# EAGLE design mapleCUx_large_210 (EAGLE 7.3.0)
MAPLE-CUx Large Version
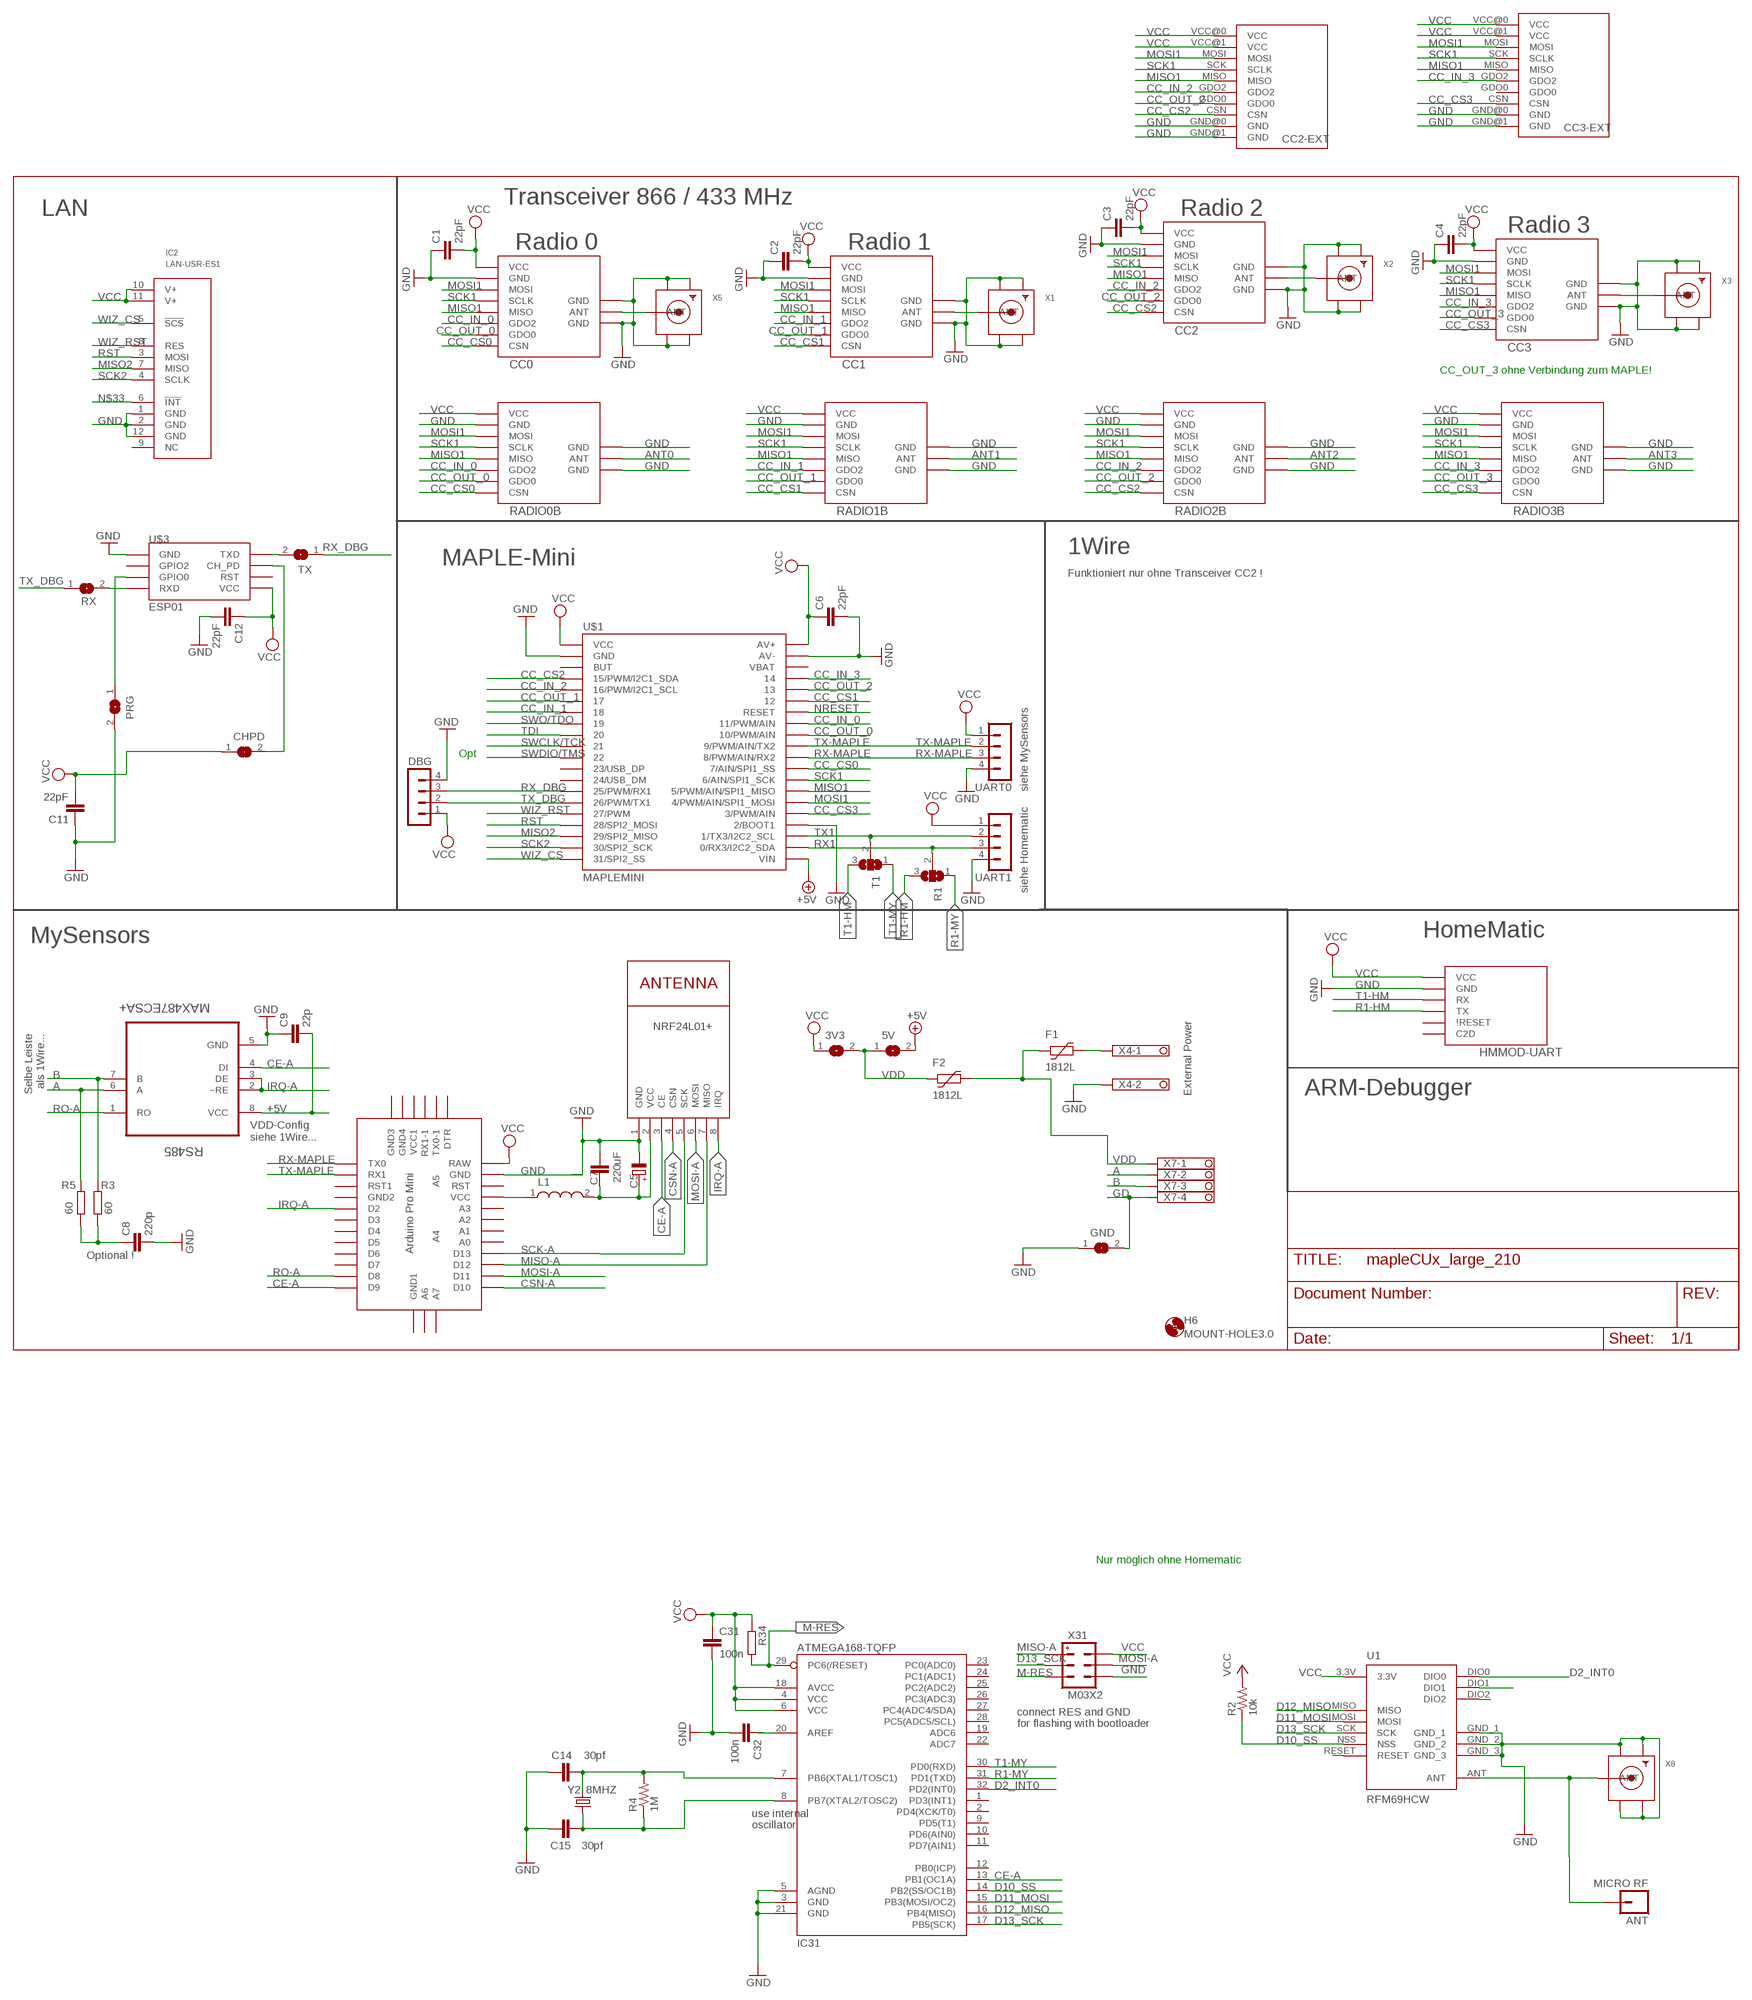
[diagram p0: schematic, sheet 1]

## Parts
3V3  SJ  [SJ]
5V  SJ  [SJ]
ANT  MICRO RF  M01PTH  [1X01]
C1  22pF  C-EUC0805  [C0805]
C2  22pF  C-EUC0805  [C0805]
C3  22pF  C-EUC0805  [C0805]
C4  22pF  C-EUC0805  [C0805]
C5  220uF  CPOL-EUE5-8.5  [E5-8,5]
C6  22pF  C-EUC0805  [C0805]
C7  C-EUC1812  [C1812]
C8  220p  C-EUC0805  [C0805]
C9  22p  C-EUC0805  [C0805]
C11  22pF  C-EUC0805  [C0805]
C12  22pF  C-EUC0805  [C0805]
C14  30pf  CAP0805  [0805]
C15  30pf  CAP0805  [0805]
C31  100n  C-EUC0805  [C0805]
C32  100n  C-EUC0805  [C0805]
CC0  CC1101  CC1101_MODULE1SMD  [CC1101_MODULE1_SMD]
CC1  CC1101_MODULE1SMD  [CC1101_MODULE1_SMD]
CC2  CC1101_MODULE1SMD  [CC1101_MODULE1_SMD]
CC2-EXT  CC1101_MODULE3_DIL  [CC1101_MODULE3_DIL]
CC3  CC1101_MODULE1SMD  [CC1101_MODULE1_SMD]
CC3-EXT  CC1101_MODULE3_DIL  [CC1101_MODULE3_DIL]
CHPD  SJ  [SJ]
DBG  MA04-1  [MA04-1]
F1  1812L  [1812L]
F2  1812L  [1812L]
GND  SJ  [SJ]
H6  MOUNT-HOLE3.0  [3,0]
HMMOD-UART  HM-MOD-UARTDIL  [HM-MOD-UART-DIL]
IC2  LAN-USR-ES1  [USR-ES1]
IC31  ATMEGA168-TQFP  [TQFP32-08]
L1  WE-KI_0805A  [WE-KI_0805A]
NRF24L01+  NRF24L01+  WIRELESS-NRF24L01  [WIRELESS-NRF24L01]
PRG  SJ  [SJ]
R1  SJ2W  [SJ_2]
R2  10k  RESISTOR0805-RES  [0805]
R3  60  R-EU_R0805  [R0805]
R4  1M  RESISTOR0805-RES  [0805]
R5  60  R-EU_R0805  [R0805]
R34  R-EU_R0805  [R0805]
RADIO0B  CC1101_MODULE1SMALL  [CC1101_MODULE1_SMD]
RADIO1B  CC1101_MODULE1SMALL  [CC1101_MODULE1_SMD]
RADIO2B  CC1101_MODULE1SMALL  [CC1101_MODULE1_SMD]
RADIO3B  CC1101_MODULE1SMALL  [CC1101_MODULE1_SMD]
RS485  MAX487ECSA+  [SOIC127P600X175-8N]
RX  SJ  [SJ]
T1  SJ2W  [SJ_2]
TX  SJ  [SJ]
U1  RFM69HCW  [RFM69HCW-XXXS2]
U$1  MAPLEMINI  [20-DIP]
U$2  ABK-PRO-MINI  [ABK-PRO-MINI]
U$3  ESP01  [ESP01]
UART0  MA04-1  [MA04-1]
UART1  MA04-1  [MA04-1]
X1  SMACONNECTOR_EDGE  [SMA_EDGELAUNCH]
X2  SMACONNECTOR_EDGE  [SMA_EDGELAUNCH]
X3  SMACONNECTOR_EDGE  [SMA_EDGELAUNCH]
X4  1751248  [1751248]
X5  SMACONNECTOR_EDGE  [SMA_EDGELAUNCH]
X7  1751264  [1751264]
X8  SMACONNECTOR_EDGE_UFL  [SMA_EDGELAUNCH_UFL]
X31  M03X2  [2X03-1.27MM_SMD]
Y2  8MHZ  CRYSTALTXC-7A  [CRYSTAL-TXC-7A]

## Nets
+5V [PWR]: 5V.2 C9.2 RS485.8(VCC) U$1.21(VIN)
A: R5.2 RS485.6(A) X7.2
ANT: ANT.1 U1.ANT X8.P(ANT)
ANT0: CC0.ANT RADIO0B.ANT X5.P(ANT)
ANT1: CC1.ANT RADIO1B.ANT X1.P(ANT)
ANT2: CC2.ANT RADIO2B.ANT X2.P(ANT)
ANT3: CC3.ANT RADIO3B.ANT X3.P(ANT)
B: R3.2 RS485.7(B) X7.3
CC_CS0: CC0.CSN RADIO0B.CSN U$1.29(7/AIN/SPI1_SS)
CC_CS1: CC1.CSN RADIO1B.CSN U$1.35
CC_CS2: CC2-EXT.CSN CC2.CSN RADIO2B.CSN U$1.4(15/PWM/I2C1_SDA)
CC_CS3: CC3-EXT.CSN CC3.CSN RADIO3B.CSN U$1.25(3/PWM/AIN)
CC_IN_0: CC0.GDO2 RADIO0B.GDO2 U$1.33(11/PWM/AIN)
CC_IN_1: CC1.GDO2 RADIO1B.GDO2 U$1.7
CC_IN_2: CC2-EXT.GDO2 CC2.GDO2 RADIO2B.GDO2 U$1.5(16/PWM/I2C1_SCL)
CC_IN_3: CC3-EXT.GDO2 CC3.GDO2 RADIO3B.GDO2 U$1.37
CC_OUT_0: CC0.GDO0 RADIO0B.GDO0 U$1.32(10/PWM/AIN)
CC_OUT_1: CC1.GDO0 RADIO1B.GDO0 U$1.6
CC_OUT_2: CC2-EXT.GDO0 CC2.GDO0 RADIO2B.GDO0 U$1.36
CC_OUT_3: CC3.GDO0 RADIO3B.GDO0
CE-A: IC31.13(PB1(OC1A)) NRF24L01+.3(CE) RS485.4(DI) U$2.D9
CSN-A: NRF24L01+.4(CSN) U$2.D10
D2_INT0: IC31.32(PD2(INT0)) U1.DIO0
D10_SS: IC31.14(PB2(SS/OC1B)) R2.1 U1.NSS
D11_MOSI: IC31.15(PB3(MOSI/OC2)) U1.MOSI
D12_MISO: IC31.16(PB4(MISO)) U1.MISO
D13_SCK: IC31.17(PB5(SCK)) U1.SCK X31.P$3
E+ [PWR]: F1.P$2 X4.1
GD [PWR]: GND.2 X7.4
GND [PWR]: C1.1 C2.1 C3.1 C4.1 C5.- C6.2 C7.1 C8.2 C9.1 C11.1 C12.2 C14.1 C15.1 C31.2 C32.2 CC0.GND@0(GND) CC0.GND@1(GND) CC0.GND@2(GND) CC1.GND@0(GND) CC1.GND@1(GND) CC1.GND@2(GND) CC2-EXT.GND@0(GND) CC2-EXT.GND@1(GND) CC2.GND@0(GND) CC2.GND@1(GND) CC2.GND@2(GND) CC3-EXT.GND@0(GND) CC3-EXT.GND@1(GND) CC3.GND@0(GND) CC3.GND@1(GND) CC3.GND@2(GND) DBG.4 GND.1 HMMOD-UART.2(GND) IC2.1(GND) IC2.2(GND) IC2.12(GND) IC31.3(GND) IC31.5(AGND) IC31.21(GND) NRF24L01+.1(GND) PRG.2 RADIO0B.GND@0(GND) RADIO0B.GND@1(GND) RADIO0B.GND@2(GND) RADIO1B.GND@0(GND) RADIO1B.GND@1(GND) RADIO1B.GND@2(GND) RADIO2B.GND@0(GND) RADIO2B.GND@1(GND) RADIO2B.GND@2(GND) RADIO3B.GND@0(GND) RADIO3B.GND@1(GND) RADIO3B.GND@2(GND) RS485.5(GND) U1.GND_1 U1.GND_2 U1.GND_3 U$1.2(GND) U$1.24(2/BOOT1) U$1.39(AV-) U$2.GND U$3.GND UART0.4 UART1.4 X1.GND@1(GND4) X1.GND@2(GND3) X1.GND@3(GND2) X1.GND@4(GND1) X2.GND@1(GND4) X2.GND@2(GND3) X2.GND@3(GND2) X2.GND@4(GND1) X3.GND@1(GND4) X3.GND@2(GND3) X3.GND@3(GND2) X3.GND@4(GND1) X4.2 X5.GND@1(GND4) X5.GND@2(GND3) X5.GND@3(GND2) X5.GND@4(GND1) X8.GND@1(GND1) X8.GND@2(GND2) X8.GND@3(GND3) X8.GND@4(GND4) X31.P$6
IRQ-A: NRF24L01+.8(IRQ) RS485.2(~RE) RS485.3(DE) U$2.D2
M-RES: IC31.29(PC6(/RESET)) R34.2 X31.P$5
MISO1: CC0.MISO CC1.MISO CC2-EXT.MISO CC2.MISO CC3-EXT.MISO CC3.MISO RADIO0B.MISO RADIO1B.MISO RADIO2B.MISO RADIO3B.MISO U$1.27(5/PWM/AIN/SPI1_MISO)
MISO2: IC2.7(MISO) U$1.18(29/SPI2_MISO)
MISO-A: NRF24L01+.7(MISO) U$2.D12 X31.P$1
MOSI1: CC0.MOSI CC1.MOSI CC2-EXT.MOSI CC2.MOSI CC3-EXT.MOSI CC3.MOSI RADIO0B.MOSI RADIO1B.MOSI RADIO2B.MOSI RADIO3B.MOSI U$1.26(4/PWM/AIN/SPI1_MOSI)
MOSI-A: NRF24L01+.6(MOSI) U$2.D11 X31.P$4
N$1 [PWR]: C5.+ C7.2 L1.2 NRF24L01+.2(VCC)
N$2 [PWR]: L1.1 U$2.VCC
N$6: C14.2 IC31.7(PB6(XTAL1/TOSC1)) R4.2 Y2.P$2
N$8: RX.2 U$3.RX(RXD)
N$10: TX.2 U$3.TX(TXD)
N$11: PRG.1 U$3.GPIO0
N$12: CHPD.2 U$3.CH_PD
N$13: C32.1 IC31.20(AREF)
N$14: U1.DIO2
N$15: U1.DIO1
N$16: U1.RESET
N$19: C15.2 IC31.8(PB7(XTAL2/TOSC2)) R4.1 Y2.P$1
N$21: C8.1 R3.1 R5.1
N$33: IC2.6(!INT!)
NRESET: U$1.34(RESET)
R1-HM: HMMOD-UART.5(TX) R1.3
R1-MY: IC31.31(PD1(TXD)) R1.1
RO-A: RS485.1(RO) U$2.D8
RST: IC2.3(MOSI) U$1.17(28/SPI2_MOSI)
RX1: R1.2 U$1.22(0/RX3/I2C2_SDA) UART1.3
RX-MAPLE: U$1.30(8/PWM/AIN/RX2) U$2.TX0 UART0.3
RX_DBG: DBG.3 TX.1 U$1.14(25/PWM/RX1)
SCK1: CC0.SCLK CC1.SCLK CC2-EXT.SCK(SCLK) CC2.SCLK CC3-EXT.SCK(SCLK) CC3.SCLK RADIO0B.SCLK RADIO1B.SCLK RADIO2B.SCLK RADIO3B.SCLK U$1.28(6/AIN/SPI1_SCK)
SCK2: IC2.4(SCLK) U$1.19(30/SPI2_SCK)
SCK-A: NRF24L01+.5(SCK) U$2.D13
SWCLK/TCK: U$1.10
SWDIO/TMS: U$1.11
SWO/TDO: U$1.8
T1-HM: HMMOD-UART.6(RX) T1.3
T1-MY: IC31.30(PD0(RXD)) T1.1
TDI: U$1.9
TX1: T1.2 U$1.23(1/TX3/I2C2_SCL) UART1.2
TX-MAPLE: U$1.31(9/PWM/AIN/TX2) U$2.RX1 UART0.2
TX_DBG: DBG.2 RX.1 U$1.15(26/PWM/TX1)
VCC [PWR]: 3V3.1 C1.2 C2.2 C3.2 C4.2 C6.1 C11.2 C12.1 C31.1 CC0.VCC CC1.VCC CC2-EXT.VCC@0(VCC) CC2-EXT.VCC@1(VCC) CC2.VCC CC3-EXT.VCC@0(VCC) CC3-EXT.VCC@1(VCC) CC3.VCC CHPD.1 DBG.1 HMMOD-UART.1(VCC) IC2.10(V+) IC2.11(V+) IC31.4(VCC) IC31.6(VCC) IC31.18(AVCC) R2.2 R34.1 RADIO0B.VCC RADIO1B.VCC RADIO2B.VCC RADIO3B.VCC U1.3.3V U$1.1(VCC) U$1.40(AV+) U$2.RAW U$3.VCC UART0.1 UART1.1 X31.P$2
VDD [PWR]: 3V3.2 5V.1 F1.P$1 F2.P$1 F2.P$2 X7.1
WIZ_CS: IC2.5(!SCS!) U$1.20(31/SPI2_SS)
WIZ_RST: IC2.8(RES) U$1.16(27/PWM)
Unconnected: CC3-EXT.GDO0 HMMOD-UART.3(C2D) HMMOD-UART.4(\!RESET) IC2.9(NC) IC31.1(PD3(INT1)) IC31.2(PD4(XCK/T0)) IC31.9(PD5(T1)) IC31.10(PD6(AIN0)) IC31.11(PD7(AIN1)) IC31.12(PB0(ICP)) IC31.19(ADC6) IC31.22(ADC7) IC31.23(PC0(ADC0)) IC31.24(PC1(ADC1)) IC31.25(PC2(ADC2)) IC31.26(PC3(ADC3)) IC31.27(PC4(ADC4/SDA)) IC31.28(PC5(ADC5/SCL)) U$1.3(BUT) U$1.12(23/USB_DP) U$1.13(24/USB_DM) U$1.38(VBAT) U$2.A0 U$2.A1 U$2.A2 U$2.A3 U$2.A4 U$2.A5 U$2.A6 U$2.A7 U$2.D3 U$2.D4 U$2.D5 U$2.D6 U$2.D7 U$2.DTR U$2.GND1(GND2) U$2.GND2(GND3) U$2.GND3(GND4) U$2.GND4(GND1) U$2.RST U$2.RST1 U$2.RX1-1 U$2.TX0-1 U$2.VCC1 U$3.GPIO2 U$3.RST

## Notes on the sheet
- Transceiver 866 / 433 MHz
- LAN | Radio 2
- Radio 3
- Radio 0 | Radio 1
- CC_OUT_3 ohne Verbindung zum MAPLE!
- 1Wire
- MAPLE-Mini
- Funktioniert nur ohne Transceiver CC2 !
- Opt
- siehe MySensors
- siehe Homematic
- MySensors | HomeMatic
- Selbe Leiste
  als 1Wire...
- External Power | ARM-Debugger
- VDD-Config
  siehe 1Wire...
- Optional !
- Nur möglich ohne Homematic
- connect RES and GND
- for flashing with bootloader
- use internal
- oscillator

## Library data of the parts
3V3 5V CHPD GND PRG RX TX = jumper:SJ: SMD solder JUMPER
ANT = SparkFun-Connectors:M01: Header 1 Standard 1-pin 0.1" header. Use with straight break away headers (SKU : PRT-00116), right angle break away headers (PRT-00553), swiss pins (PRT-00743), machine pins (PRT-00117), and female headers (PRT-00115).
C1-C4 C6-C9 C11 C12 C31 C32 = rcl:C-EU: CAPACITOR, European symbol
C5 = rcl:CPOL-EU: POLARIZED CAPACITOR, European symbol
C14 C15 = doug:CAP: Capacitor Standard 0603 ceramic capacitor, and 0.1" leaded capacitor.
CC0 CC1-CC3 = wireless:CC1101_MODULE1: CC1101 wireless module for 433/868 MHz (sold from Aliexpress). DIL version for mounting with pin header (and SMD soldering) and SMD only variant available.
CC2-EXT CC3-EXT = wireless:CC1101_MODULE3_DIL: 433 Mhz CC1101 wireless module named RF1101SE V3.1 package special has only limited silk screen on tPlace layer
DBG UART0 UART1 = con-lstb:MA04-1: PIN HEADER; OC_FARNELL: unknown; OC_NEWARK: unknown
F1 F2 = ptc-littlefuse:1812L
H6 = holes:MOUNT-HOLE: MOUNTING HOLE with drill center marker
HMMOD-UART = wireless:HM-MOD-UART: eQ3 HM-MOD-UART-AW-SH2 wireless module for 868 MHz. DIL version for mounting with pin header (antenna upwards) and SMD variant available (antenna downwards).
IC2 = Martin-Communication:LAN-USR-ES1
IC31 = atmel:ATMEGA168: Atmel Atmega 168/328/328P
L1 = EAGLE-EMC_COMPONENTS-rev17a:WE-KI: SMD Wire Wound Ceramic Inductor Characteristics WE-KI series offers you an excellent Q factor and highest possible self resonant frequencies up to 12.5 GHz Inductance tolerances: 5% (2% on request) High thermal stability Operating temperature: –40°C to +125°C Applications Especially developed for high frequency applications RF transceiver/communications Bluetooth Wireless LAN <http://katalog.we-online.de/media/images/v2/Family_WE-KI.jpg> Details see: http://katalog.we-online.de/en/pbs/WE-KI Updated by Dan Xu 2014-07-08 2014 (C) Wurth Elektronik
NRF24L01+ = diy-modules:WIRELESS-NRF24L01: 2.4 GHz Wireless Module based on NRF24L01 chip
R1 T1 = jumper:SJ2W: SMD solder JUMPER
R2 R4 = doug:RESISTOR: Resistor Basic schematic elements and footprints for 0603, 1206, and PTH resistors.
R3 R5 R34 = rcl:R-EU_: RESISTOR, European symbol
RADIO0B RADIO1B RADIO2B RADIO3B = Martin-Communication:CC1101_MODULE1: CC1101 wireless module for 433/868 MHz (sold from Aliexpress). DIL version for mounting with pin header (and SMD soldering) and SMD only variant available.
RS485 = Maxim_By_element14_Batch_1:MAX487ECSA+: Low-Power, Slew-Rate-Limited RS-485/RS-422 Transceivers; MPN: MAX487ECSA+; OC_FARNELL: 9724532; OC_NEWARK: 68K4803; PACKAGE: SOIC-8; SUPPLIER: Maxim
U1 = doug:RFM69H
U$1 = maplemini-small:MAPLEMINI
U$2 = Arduino-clone:ABK-PRO-MINI: ABK Pro-Mini Arduino Clone
U$3 = esp8266modules:ESP01: ESP8266 Wifi module 01
X1-X3 X5 X8 = adafruit:SMACONNECTOR: SMA Connector 90° DIP SMA Connector, 50 Ohm (4UConnector: 07259)
X4 = con-phoenix-350:1751248: MKDS 1/ 2-3,5 Printklemme Nennstrom: 10 A Bemessungsspannung: 160 V Raster: 3,5 mm Polzahl: 2 Montageart: Löten Anschlussart: Schraubanschluss Anschlussrichtung vom Leiter zur Platine: 0° Source: http://eshop.phoenixcontact.com .. 1751248.pdf; OC_FARNELL: unknown; OC_NEWARK: unknown
X7 = con-phoenix-350:1751264: MKDS 1/ 4-3,5 Printklemme Nennstrom: 10 A Bemessungsspannung: 160 V Raster: 3,5 mm Polzahl: 4 Montageart: Löten Anschlussart: Schraubanschluss Anschlussrichtung vom Leiter zur Platine: 0° Source: http://eshop.phoenixcontact.com .. 1751264.pdf; MPN: 1751264; OC_FARNELL: unknown; OC_NEWARK: 10R0934
X31 = mechanics:M03X2
Y2 = SparkFun-FreqCtrl:CRYSTAL: Various standard crystals. Proven footprints.

## Net classes
0 default: width 0.305 mm
1 PWR: width 0.457 mm

## Board
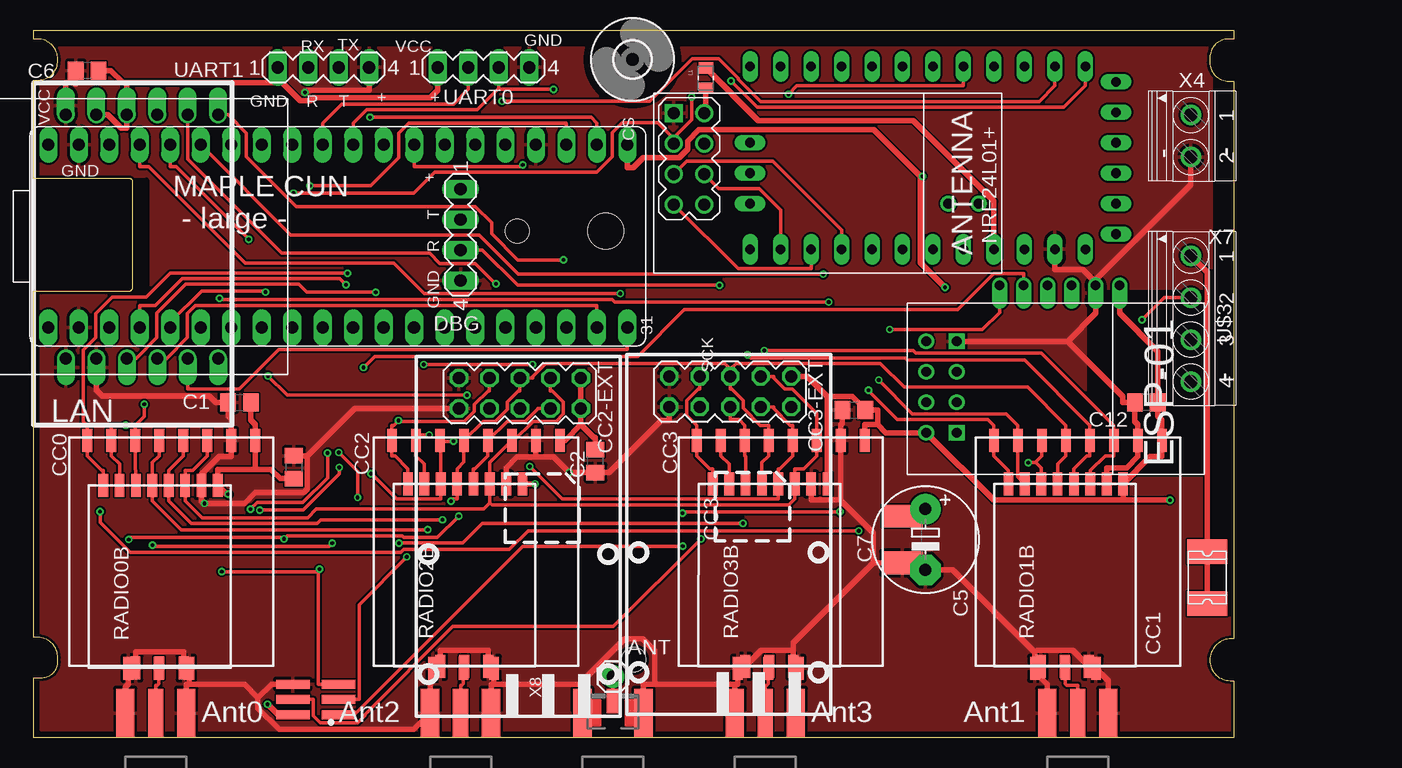
[diagram p1: board, top side]
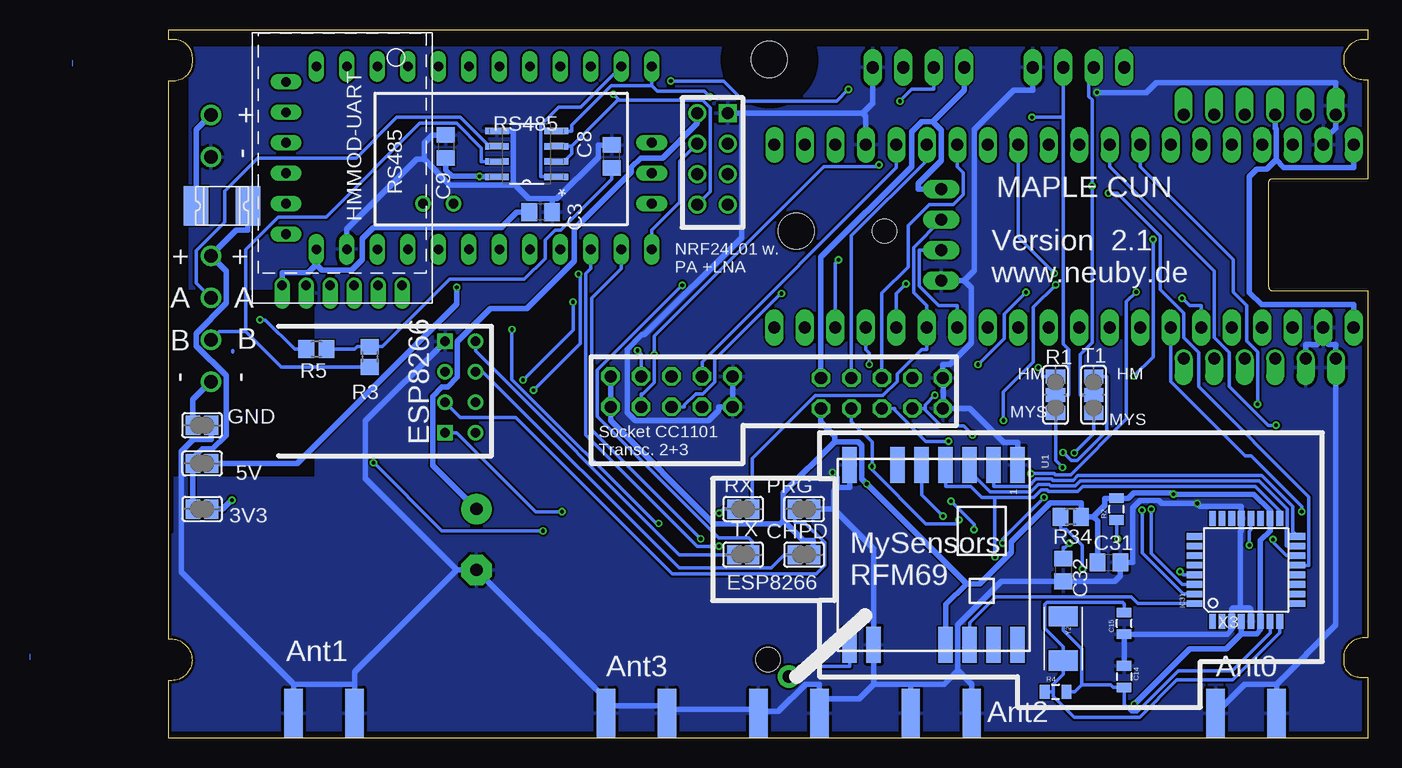
[diagram p2: board, bottom side, seen from below]

Size 100 x 59 mm. Coordinates in mm from the lower left corner, seen from the top.
Outline: 0,0 0,5 0.71,5 arc90 2,6.29 2,6.67 arc90 0.32,8.35 0,8.35 0,37.21 7.89,37.21 arc90 8.26,37.58 8.26,46.32 arc90 7.97,46.61 0,46.61 0,54.83 0.39,54.83 arc90 2,56.44 2,56.57 arc90 0.33,58.24 0,58.24 0,59 100,59 100,58.24 99.54,58.24 arc90 98,56.7 98,56.41 arc90 99.41,54.75 100,54.75 100,8.24 99.8,8.24 arc90 98,6.44 arc90 99.69,4.75 100,4.75 100,0 0,0
Copper layers (1*16): Top 0.035mm / dielectric 1.5mm / Bottom 0.035mm
Design rules "SeeedStudio_2layer_DRU_no_angle_20140221": minimum track width 6mil, minimum drill 12mil, track to track 6mil, track to pad 6mil, pad to pad 6mil, via to via 6mil, smd to smd 0mil, copper to edge 10mil, drill to drill 10mil, minimum pad ring 10mil, minimum via ring 6mil, stop-mask expansion 2mil, vias tented up to drill 100mil, thermal gap 10mil
Holes 2 mm at 50,6.5 40.28,42.23
Holes 3 mm at 47.65,42.23
tRestrict: area 0,37.3 to 9.4,46.5; area 1.9,17.1 to 100.3,59.1
bRestrict: area 0,37.3 to 9.4,46.5; area 1.9,17.1 to 100.3,59.1

### Footprints (pad centres in the part's own frame; a part is rotated, then mirrored left to right if it is on the bottom)
SJ = smd 1.168 x 1.6: 1 -0.762,0; 2 0.762,0
1X01 = drill 1.016 pad 1.88: 1 0,0
C0805 = smd 1.3 x 1.5: 1 -0.95,0; 2 0.95,0
E5-8,5 = drill 1.016 pad 2.54: + -2.54,0 | drill 1.016 pad 2.54 octagon: - 2.54,0
C1812 = smd 1.9 x 3.4: 1 -1.95,0; 2 1.95,0
0805 = smd 0.8 x 1.2: 1 -0.9,0; 2 0.9,0
CC1101_MODULE1_SMD = smd 1.93 x 0.813: ANT 19,5.96; CSN 0,0; GDO0 0,2; GDO2 0,4; GND@0 0,12; GND@1 19,8.5; GND@2 19,3.42; MISO 0,6; MOSI 0,10; SCLK 0,8; VCC 0,14
CC1101_MODULE3_DIL = drill 1.016 octagon: CSN 1.81,6.1; GDO0 4.35,6.1; GDO2 4.35,8.64; GND@0 1.81,3.56; GND@1 4.35,3.56; MISO 1.81,8.64; MOSI 1.81,11.18; SCK 4.35,11.18; VCC@0 1.81,13.72; VCC@1 4.35,13.72
MA04-1 = drill 1.016 long: 1 -3.81,0; 2 -1.27,0; 3 1.27,0; 4 3.81,0
1812L = smd 2.03 x 3.3: P$1 -2.16,0; P$2 2.16,0
3,0 = hole 3: 0,0
HM-MOD-UART-DIL = drill 0.8 offset: 1 0,12; 2 0,10; 3 0,8; 4 0,6; 5 0,4; 6 0,2
USR-ES1 = drill 1 pad 1.35 offset: 1 -10.16,5.715; 2 -10.16,3.175; 3 -10.16,0.635; 4 -10.16,-1.905; 5 -10.16,-4.445; 6 -10.16,-6.985; 7 10.16,-6.985; 8 10.16,-4.445; 9 10.16,-1.905; 10 10.16,0.635; 11 10.16,3.175; 12 10.16,5.715
TQFP32-08 = smd 1.27 x 0.559: 1 -4.293,2.8; 2 -4.293,2; 3 -4.293,1.2; 4 -4.293,0.4; 5 -4.293,-0.4; 6 -4.293,-1.2; 7 -4.293,-2; 8 -4.293,-2.8; 17 4.293,-2.8; 18 4.293,-2; 19 4.293,-1.2; 20 4.293,-0.4; 21 4.293,0.4; 22 4.293,1.2; 23 4.293,2; 24 4.293,2.8 | smd 0.559 x 1.27: 9 -2.8,-4.293; 10 -2,-4.293; 11 -1.2,-4.293; 12 -0.4,-4.293; 13 0.4,-4.293; 14 1.2,-4.293; 15 2,-4.293; 16 2.8,-4.293; 25 2.8,4.293; 26 2,4.293; 27 1.2,4.293; 28 0.4,4.293; 29 -0.4,4.293; 30 -1.2,4.293; 31 -2,4.293; 32 -2.8,4.293
WE-KI_0805A = smd 0.925 x 1.2: 1 -0.838,0; 2 0.838,0
WIRELESS-NRF24L01 = drill 1 square: 1 -12.7,6.35 | drill 1: 2 -10.16,6.35; 3 -12.7,3.81; 4 -10.16,3.81; 5 -12.7,1.27; 6 -10.16,1.27; 7 -12.7,-1.27; 8 -10.16,-1.27
SJ_2 = smd 1.168 x 1.6: 1 -1.524,0; 2 0,0; 3 1.524,0
R0805 = smd 1.3 x 1.5: 1 -0.85,0; 2 0.85,0
CC1101_MODULE1_SMD' = smd 1.93 x 0.813: ANT 14.889,4.381; CSN -0.318,-0.318; GDO0 -0.318,1.048; GDO2 -0.318,2.413; GND@0 -0.318,7.872; GND@1 14.889,6.381; GND@2 14.889,2.381; MISO -0.318,3.777; MOSI -0.318,6.508; SCLK -0.318,5.143; VCC -0.318,9.238
SOIC127P600X175-8N = smd 1.981 x 0.533: 1 -2.464,1.905; 2 -2.464,0.635; 3 -2.464,-0.635; 4 -2.464,-1.905; 5 2.464,-1.905; 6 2.464,-0.635; 7 2.464,0.635; 8 2.464,1.905
RFM69HCW-XXXS2 = smd 3 x 1.2: 3.3V 7.5,1; ANT 7.5,-7; DIO0 7.5,3; DIO1 7.5,5; DIO2 7.5,7; GND_1 7.5,-5; GND_2 -7.5,-7; GND_3 -7.5,7; MISO -7.5,5; MOSI -7.5,3; NSS -7.5,-1; RESET -7.5,-3; SCK -7.5,1
20-DIP = drill 1.016 pad 1.27 long: 1 -24.13,-7.62; 2 -21.59,-7.62; 3 -19.05,-7.62; 4 -16.51,-7.62; 5 -13.97,-7.62; 6 -11.43,-7.62; 7 -8.89,-7.62; 8 -6.35,-7.62; 9 -3.81,-7.62; 10 -1.27,-7.62; 11 1.27,-7.62; 12 3.81,-7.62; 13 6.35,-7.62; 14 8.89,-7.62; 15 11.43,-7.62; 16 13.97,-7.62; 17 16.51,-7.62; 18 19.05,-7.62; 19 21.59,-7.62; 20 24.13,-7.62 | drill 1 pad 1.27 long: 21 24.13,7.62; 22 21.59,7.62; 23 19.05,7.62; 24 16.51,7.62; 25 13.97,7.62; 26 11.43,7.62; 27 8.89,7.62; 28 6.35,7.62; 29 3.81,7.62; 30 1.27,7.62; 31 -1.27,7.62; 32 -3.81,7.62; 33 -6.35,7.62; 34 -8.89,7.62; 35 -11.43,7.62; 36 -13.97,7.62; 37 -16.51,7.62; 38 -19.05,7.62; 39 -21.59,7.62; 40 -24.13,7.62
ABK-PRO-MINI = drill 0.8 long: A0 10.16,-3.81; A1 10.16,-6.35; A2 10.16,-8.89; A3 10.16,-11.43; A6 3.81,-21.59; A7 6.35,-21.59; D2 -5.08,-3.81; D3 -5.08,-6.35; D4 -5.08,-8.89; D5 -5.08,-11.43; D6 -5.08,-13.97; D7 -5.08,-16.51; D8 -5.08,-19.05; D9 -5.08,-21.59; D10 10.16,-21.59; D11 10.16,-19.05; D12 10.16,-16.51; D13 10.16,-13.97; DTR 8.89,8.89; GND 10.16,3.81; GND1 -5.08,-1.27; GND2 -3.81,8.89; GND3 -1.27,8.89; GND4 1.27,-21.59; RAW 10.16,6.35; RST 10.16,1.27; RST1 -5.08,1.27; RX1 -5.08,3.81; RX1-1 3.81,8.89; TX0 -5.08,6.35; TX0-1 6.35,8.89; VCC 10.16,-1.27; VCC1 1.27,8.89 | drill 0.8: A4 6.35,-5.08; A5 6.35,-2.54
ESP01 = drill 0.8: CH_PD -1.285,-8.178; GPIO0 1.255,-5.638; GPIO2 -1.285,-5.638; RST 1.255,-8.178; TX -3.825,-8.178; VCC 3.795,-8.178 | drill 0.8 square: GND -3.825,-5.638; RX 3.795,-5.638
SMA_EDGELAUNCH = smd 4.064 x 1.524: GND@1 2.032,-2.54; GND@2 2.032,2.54 | smd 4.064 x 1.524 bottom: GND@3 2.032,2.54; GND@4 2.032,-2.54 | smd 4.064 x 1.27: P 2.032,0
1751248 = drill 1.1 pad 1.7: 1 -1.75,-0.1; 2 1.75,-0.1
1751264 = drill 1.1 pad 1.7: 1 -5.25,-0.1; 2 -1.75,-0.1; 3 1.75,-0.1; 4 5.25,-0.1
SMA_EDGELAUNCH_UFL = smd 4.064 x 1.524: GND@1 2.032,-2.54; GND@2 2.032,2.54 | smd 4.064 x 1.524 bottom: GND@3 2.032,2.54; GND@4 2.032,-2.54 | smd 2.032 x 1.016: P 3.048,0
2X03-1.27MM_SMD = smd 0.75 x 2.8: P$1 -1.27,-1.905; P$2 -1.27,1.905; P$3 0,-1.905; P$4 0,1.905; P$5 1.27,-1.905; P$6 1.27,1.905
CRYSTAL-TXC-7A = smd 1.7 x 2.4: P$1 1.85,0; P$2 -1.85,0

### Placement (x,y rotation side)
3V3  97.16,19.05 180 bottom
5V  97.16,22.86 0 bottom
ANT  48.26,5.08 0 top
C1  17.14,27.94 0 top
C2  46.81,23.05 90 top
C3  68.94,43.81 180 bottom
C4  68.33,27.3 0 top
C5  74.3,16.51 270 top
C6  4.45,55.61 180 top
C7  72.39,16.51 90 top
C8  63.03,48.45 90 bottom
C9  76.83,49.3 270 bottom
C11  21.66,22.55 270 top
C12  92.71,27.94 180 top
C14  20.32,5.08 270 bottom
C15  20.32,9.53 90 bottom
C31  21.59,14.61 0 bottom
C32  25.4,13.97 270 bottom
CC0  4.45,24.77 270 top
CC1  80.01,24.77 270 top
CC2  29.84,24.77 270 top
CC2-EXT  31.87,31.79 270 top
CC3  55.24,24.77 270 top
CC3-EXT  49.4,31.93 270 top
CHPD  46.99,15.24 180 bottom
DBG  35.56,41.91 270 top
F1  95.5,44.32 180 bottom
F2  97.79,13.34 270 top
GND  97.16,26.04 180 bottom
H6  49.89,56.55 0 top
HMMOD-UART  78.49,37.72 90 bottom
IC2  8.38,41.78 90 top
IC31  10.16,13.97 90 bottom
L1  56,55 270 top
NRF24L01+  66.04,45.72 0 top
PRG  46.99,19.05 0 bottom
R1  26.04,28.57 90 bottom
R2  20.95,19.05 90 bottom
R3  83.19,31.75 270 bottom
R4  26.04,3.81 0 bottom
R5  87.63,32.38 180 bottom
R34  24.77,18.41 180 bottom
RADIO0B  CC1101_MODULE1SMALL  [CC1101_MODULE1_SMD']  6.1,20.7 270 top
RADIO1B  CC1101_MODULE1SMALL  [CC1101_MODULE1_SMD']  81.53,20.83 270 top
RADIO2B  CC1101_MODULE1SMALL  [CC1101_MODULE1_SMD']  31.5,20.83 270 top
RADIO3B  CC1101_MODULE1SMALL  [CC1101_MODULE1_SMD']  56.9,20.83 270 top
RS485  70.12,48.66 180 bottom
RX  52.07,19.05 180 bottom
T1  22.86,28.57 90 bottom
TX  52.07,15.24 180 bottom
U1  36.2,15.24 270 bottom
U$1  25.34,41.8 0 top
U$2  81.28,50.87 270 top
U$3  82.55,29.21 270 top
UART0  37.47,55.88 0 top
UART1  24.13,55.88 0 top
X1  87,0 90 top
X2  35.56,0 90 top
X3  60.96,0 90 top
X4  96.52,50.16 270 top
X5  10.16,0 90 top
X7  96.52,34.92 270 top
X8  48.26,0 90 top
X31  23.5,3.17 90 top
Y2  25.4,8.26 270 bottom

### Tracks (layer width: path | path; a pad name or v marks a point on that pad's centre or on a via)
+5V  (via drill 0.3 pad 0.61)
  Top 0.457: U$1.21 49.47,47.53 49.94,47.53 50.77,48.37 53.78,48.37 54.48,49.06 54.48,49.74 55.42,50.68 69.99,50.68 73.86,46.8 | 73.86,46.8 73.86,39.61 v75.94,37.53 | 73.86,46.8 v74.05,46.8
  Bottom 0.457: RS485.8 73.96,46.76 74,46.8 v74.05,46.8 76.32,46.8 76.83,47.32 C9.2 | 5V.2 89.23,22.86 75.94,36.15 v75.94,37.53
A  (via drill 0.3 pad 0.61)
  Top 0.305: X7.2 94.19,36.67 v92.34,34.83
  Bottom 0.305: v92.34,34.83 91.88,34.83 89.44,32.38 R5.2 | X7.2 97.63,37.89 97.63,40.62 95.27,42.98 95.27,45.57 92.5,48.33 84.31,48.33 80.92,51.72 75.64,51.72 73.22,49.3 RS485.6
ANT
  Top 0.305: X8.P ANT.1
  Bottom 0.305: U1.ANT 43.2,5.93 47.41,5.93 ANT.1
ANT0
  Top 0.305: X5.P 10.16,4.37 10.28,4.37 10.4,4.5 CC0.ANT 10.45,5.81 RADIO0B.ANT
ANT1
  Top 0.305: RADIO1B.ANT 85.97,5.88 CC1.ANT 85.97,4.5 86.1,4.37 87,4.37 X1.P
ANT2
  Top 0.305: RADIO2B.ANT 35.8,5.87 CC2.ANT 35.8,4.5 35.68,4.37 35.56,4.37 X2.P
ANT3
  Top 0.305: RADIO3B.ANT 61.2,5.87 CC3.ANT 61.2,4.5 61.08,4.37 60.96,4.37 X3.P
B
  Bottom 0.305: R3.2 90.56,30.9 93.52,33.85 | 93.52,33.85 95.74,33.85 X7.3 | 93.52,33.85 93.52,40.7 90.81,43.41 86.81,43.41 79.02,51.21 75.95,51.21 73.88,49.14 73.88,48.03 RS485.7
CC_CS0  (via drill 0.3 pad 0.61)
  Top 0.305: v26.14,38.72 11.37,38.72 9.39,36.73 6.55,36.73 5.18,35.36 5.18,33.34 4.14,32.3 4.14,26.34 4.45,26.04 CC0.CSN 4.45,23.5 5.65,22.29 5.78,22.29 RADIO0B.CSN
  Bottom 0.305: U$1.29 29.15,41.72 v26.14,38.72
CC_CS1  (via drill 0.3 pad 0.61)
  Top 0.305: v69.55,28.95 71.96,26.54 79.51,26.54 80.01,26.04 CC1.CSN 80.01,23.5 81.22,22.29 RADIO1B.CSN | U$1.35 21.42,41.91 37.1,41.91 40.37,38.64 v65.79,38.64
  Bottom 0.305: v65.79,38.64 65.63,38.48 65.63,32.87 v69.55,28.95
CC_CS2  (via drill 0.3 pad 0.61)
  Top 0.305: v26.02,37.74 25.5,38.26 12.36,38.26 10.11,36.01 8.83,36.01 U$1.4 | RADIO2B.CSN 31.18,22.42 30.1,23.5 29.84,23.5 CC2.CSN 29.84,26.04 29.98,26.04 v30.39,26.44 30.46,26.37 35.87,26.37 36.7,27.2 36.7,27.75 37.86,28.91 37.97,28.91 CC2-EXT.CSN
  Bottom 0.305: v30.39,26.44 30.39,28.8 27.88,31.31 27.88,35.88 v26.02,37.74
CC_CS3
  Top 0.305: RADIO3B.CSN 56.58,22.42 56.32,22.42 55.24,23.5 CC3.CSN 55.24,26.04 54.42,26.86 54.42,28.1 55.36,29.05 55.49,29.05 CC3-EXT.CSN
  Bottom 0.305: CC3-EXT.CSN 55.49,31.32 39.31,47.51 U$1.25
CC_IN_0  (via drill 0.3 pad 0.61)
  Top 0.305: RADIO0B.GDO2 8.51,22.29 8.45,22.35 CC0.GDO2 8.45,26.04 9.2,26.79 v9.2,27.78
  Bottom 0.305: U$1.33 18.99,47.61 11.22,39.84 11.22,37.13 10.1,36.01 10.1,33.05 9.2,32.16 v9.2,27.78
CC_IN_1  (via drill 0.3 pad 0.61)
  Top 0.305: v68.74,17.23 41.19,17.23 39.63,15.67 30.83,15.67 30.59,15.43 8.04,15.43 5.53,17.95 v5.53,18.84 | CC1.GDO2 84.01,23.5 83.48,22.97 83.48,22.92 | 83.48,22.92 v82.86,22.92 | RADIO1B.GDO2 83.95,22.46 83.48,22.92
  Bottom 0.305: v68.74,17.23 77.17,17.23 v82.86,22.92 | U$1.7 16.45,29.7 10.22,23.47 9.74,23.47 5.53,19.26 v5.53,18.84
CC_IN_2  (via drill 0.3 pad 0.61)
  Top 0.305: U$1.5 11.37,34.64 13.98,37.25 19.22,37.25 v19.32,37.15 | 33.91,24.7 v34.97,24.7 | CC2.GDO2 33.91,24.7 | 33.91,24.7 33.91,22.42 RADIO2B.GDO2 33.91,19.88 30.23,19.88 v28.11,22
  Bottom 0.305: v28.11,22 v28.1,22.01 26.17,22.01 26.06,21.9 24.77,21.9 20.13,26.54 20.13,36.34 v19.32,37.15 | CC2-EXT.GDO2 39.44,27.44 39.44,27.31 36.84,24.7 v34.97,24.7
CC_IN_3  (via drill 0.3 pad 0.61)
  Top 0.305: v48.87,37.02 32.56,37.02 30,39.57 17.6,39.57 9.56,47.61 8.83,47.61 U$1.37 | CC3-EXT.GDO2 58.03,26.51 58.77,26.51 59.24,26.04 CC3.GDO2 59.24,23.5 59.31,23.43 RADIO3B.GDO2
  Bottom 0.305: CC3-EXT.GDO2 56.97,27.57 56.97,27.71 56.03,28.64 55.45,28.64 54.43,29.66 54.43,31.53 48.94,37.02 v48.87,37.02
CC_OUT_0  (via drill 0.3 pad 0.61)
  Top 0.305: v7.66,26.04 6.45,26.04 CC0.GDO0 6.45,23.5 7.14,22.8 RADIO0B.GDO0
  Bottom 0.305: v7.66,26.04 8.31,26.04 11.56,29.28 11.56,32.1 12.8,33.34 12.8,38.88 21.53,47.61 U$1.32
CC_OUT_1  (via drill 0.3 pad 0.61)
  Top 0.305: v15.49,36.63 15.61,36.51 48.22,36.51 48.42,36.31 v66.24,36.31 | v70.41,29.81 73.22,27 81.05,27 82.01,26.04 CC1.GDO0 82.01,21.72 RADIO1B.GDO0
  Bottom 0.305: U$1.6 13.91,36.01 14.86,36.01 v15.49,36.63 | v70.41,29.81 66.24,33.98 v66.24,36.31
CC_OUT_2  (via drill 0.3 pad 0.61)
  Top 0.305: RADIO2B.GDO0 32.54,22.8 31.84,23.5 CC2.GDO0 32.31,25.23 v32.95,25.23 | U$1.36 11.37,47.61 11.85,47.61 v17.91,41.55 | v19.52,30.14 21.12,28.54 v36.1,28.54
  Bottom 0.305: 36.9,27.44 36.9,27.74 v36.1,28.54 | CC2-EXT.GDO0 36.9,27.44 | 36.9,27.44 36.9,27.31 35.58,25.98 33.7,25.98 v32.95,25.23 | v17.91,41.55 17.91,31.75 v19.52,30.14
CC_OUT_3
  Top 0.305: CC3.GDO0 57.24,23.5 57.94,22.8 RADIO3B.GDO0
CE-A  (via drill 0.3 pad 0.61)
  Top 0.305: 53.3,49.99 52.01,51.27 49.04,51.27 48.22,50.44 48.22,48.44 46.91,47.13 33.4,47.13 31.66,45.39 v21.63,45.39 | NRF24L01+.3 53.34,49.95 53.3,49.99 | 53.3,49.99 54.82,51.51 v54.82,53.42
  Bottom 0.305: v21.63,45.39 20.89,45.39 17.3,41.8 17.3,37.36 15.34,35.4 15.34,33.34 14.1,32.1 14.1,29.25 4.92,20.07 4.92,14.38 4.93,14.37 IC31.13 | U$2.D9 59.69,54.34 | RS485.4 66.36,50.57 66.36,51.05 63.08,54.34 59.69,54.34 | 59.69,54.34 59.25,53.9 55.3,53.9 v54.82,53.42
CSN-A
  Bottom 0.305: U$2.D10 59.69,42.32 57.36,44.65 57.36,48.05 NRF24L01+.4
D2_INT0
  Bottom 0.305: U1.DIO0 33.2,9.54 31.02,11.72 19.75,11.72 19.2,11.17 IC31.32
D10_SS  (via drill 0.3 pad 0.61)
  Top 0.305: v35.41,18.45 33.63,16.67 30.84,16.67 30.68,16.83 21.12,16.83 v20.85,16.56 20.72,16.69 8.08,16.69 v7.91,16.51
  Bottom 0.305: IC31.14 6.81,15.17 7.91,16.27 v7.91,16.51 | R2.1 20.95,16.66 v20.85,16.56 | U1.NSS 37.2,20.23 v35.41,18.45
D11_MOSI
  Bottom 0.305: U1.MOSI 33.2,22.18 31.49,20.47 28.1,20.47 27.48,21.09 26.55,21.09 26.44,20.99 24.39,20.99 23.98,21.4 9.07,21.4 6.74,19.07 6.74,17.39 6.81,17.32 6.81,15.97 IC31.15
D12_MISO
  Bottom 0.305: IC31.16 6.28,17.18 6.28,19.28 8.86,21.86 24.17,21.86 24.58,21.45 26.25,21.45 26.36,21.55 27.67,21.55 28.29,20.93 31.2,20.93 U1.MISO
D13_SCK  (via drill 0.3 pad 0.61)
  Top 0.305: X31.P$3 27.11,3.17 27.11,11.08 v31.08,15.06
  Bottom 0.305: 31.08,20.02 27.86,20.02 27.24,20.64 26.73,20.64 26.63,20.53 24.2,20.53 23.79,20.94 9.4,20.94 7.36,18.9 IC31.17 | 31.08,20.02 32.17,20.02 33.09,20.93 35.2,20.93 U1.SCK | v31.08,15.06 31.08,20.02
E+
  Bottom 0.457: X4.1 97.66,50.67 F1.P$2
GD
  Bottom 0.457: X7.4 97.92,28.18 GND.2
GND  (via drill 0.3 pad 0.61)
  Top 0.457: 18.67,3.31 18.67,2.45 20.43,0.69 31.67,0.69 X2.GND@3 33.02,4.45 33.27,4.69 CC2.GND@2 33.7,5.76 RADIO2B.GND@2 33.88,7.29 37.88,7.29 RADIO2B.GND@1 38.17,5.94 CC2.GND@1 38.34,4.45 | v22.59,53.78 22.78,53.98 27.94,53.98 UART1.4 | v14.23,19.54 17.57,19.54 18.46,20.43 22.5,20.43 22.8,20.72 22.8,23.5 | 12.48,6.49 12.95,6.02 CC0.GND@1 12.95,4.45 | 12.48,6.49 12.48,7.16 8.48,7.16 RADIO0B.GND@2 7.91,5.81 CC0.GND@2 7.87,4.42 7.62,4.17 X5.GND@3 | RADIO0B.GND@1 12.48,6.49 | 12.95,4.45 12.95,4.42 17.56,4.42 18.67,3.31 | 12.95,4.45 12.7,4.45 X5.GND@4 | 18.67,3.31 19.81,4.45 X31.P$6 | 18.67,3.31 | CC2-EXT.GND@1 26.74,27.44 22.8,23.5 | RADIO3B.GND@0 64.77,19.8 67.2,19.8 | 69.95,14.56 69.95,17.04 67.2,19.8 | IC2.12 2.67,54.59 3.39,54.59 3.5,54.48 C6.2 | C4.1 67.38,26.17 67.32,26.11 67.25,26.11 CC3.GND@0 67.25,19.85 67.2,19.8 | IC2.2 5.21,28.98 5.72,28.47 14.64,28.47 15.16,27.94 C1.1 16.2,26.81 16.45,26.56 CC0.GND@0 16.45,23.42 15.45,23.42 13.97,21.94 RADIO0B.GND@0 13.97,19.67 14.09,19.67 v14.23,19.54 | CC3-EXT.GND@1 52.95,26.43 52.27,26.43 47.94,22.09 C2.1 v44.63,22.09 v44.62,22.1 43.34,23.39 41.84,23.39 | RADIO2B.GND@0 39.37,22.49 40.26,23.39 41.84,23.39 | X2.GND@1 38.1,4.45 38.34,4.45 | 51.74,4.45 58.39,4.45 58.42,4.42 | 58.42,4.42 | 51.74,4.45 50.8,4.45 X8.GND@4 | 45.72,4.45 45.72,4.71 49.25,8.24 50.73,8.24 51.74,7.24 51.74,4.45 | 38.34,4.45 45.72,4.45 | X3.GND@4 63.5,4.17 63.74,4.42 CC3.GND@1 63.57,5.94 RADIO3B.GND@1 63.28,7.29 | X1.GND@3 84.45,4.45 83.52,5.38 83.52,5.76 | 83.52,5.76 CC1.GND@2 83.43,7.11 | RADIO1B.GND@2 83.69,5.94 83.52,5.76 | X8.GND@3 45.72,4.45 | RADIO1B.GND@0 89.41,22.49 91.08,22.49 92.01,23.42 CC1.GND@0 92.01,26.11 91.76,26.36 C12.2 90.73,27.94 90.73,28.45 86.14,33.03
  Top 0.457: U$2.GND 85.09,39.02 87.41,39.02 88.38,38.05 | X4.2 96.42,46.1 88.38,38.05 | 88.38,38.05 88.49,37.94 HMMOD-UART.2 88.49,35.38 86.14,33.03 | 58.42,4.42 58.66,4.42 CC3.GND@2 59.1,5.76 RADIO3B.GND@2 60.62,7.29 63.28,7.29 | X3.GND@3 58.42,4.42 | 69.95,14.56 C7.1 72.64,14.31 72.64,13.97 C5.- 76.57,13.97 83.43,7.11 | CC2.GND@0 41.84,23.39 | 83.43,7.11 83.6,7.29 86.57,7.29 RADIO1B.GND@1 88.34,5.94 CC1.GND@1 89.53,4.74 X1.GND@4 | C11.1 22.8,23.5 | U$3.GND 86.14,33.03 | 63.28,7.29 63.28,7.88 69.95,14.56 | v14.23,19.54 v14.23,19.53
  Bottom 0.457: UART1.4 27.94,53.98 29.53,53.98 32.83,50.67 32.83,38.92 33.66,38.1 | 33.66,38.1 33.08,37.52 33.08,32.9 34.86,31.12 35.43,31.12 CC2-EXT.GND@0 35.41,29.96 35.41,27.46 CC2-EXT.GND@1 33.19,27.44 30.37,24.62 29.2,24.62 U1.GND_3 | DBG.4 33.66,38.1 | v22.59,53.78 18.46,53.78 17.66,54.59 2.67,54.59 IC2.12 2.67,50.81 3.75,49.73 U$1.39 | 10.65,10.82 11.23,10.82 11.36,10.69 IC31.3 11.36,9.01 11.75,8.62 C15.1 C14.1 | 10.65,10.82 9.89,10.82 9.76,10.69 IC31.5 | 10.65,10.82 10.65,17.15 10.56,17.25 IC31.21 10.56,19.28 13.98,19.28 v14.23,19.53 17.18,19.53 17.43,19.78 18.99,19.78 19.61,19.16 19.61,14.61 C31.2 20.64,13.47 21.09,13.02 C32.2 30.56,13.02 34.18,9.41 34.18,5.6 | 3.75,33.23 4.21,32.76 5.21,32.76 IC2.2 | 3.75,33.23 3.28,32.76 2.67,32.76 IC2.1 2.67,9.4 7.62,4.45 | U$1.2 3.75,33.23 | X5.GND@3 7.62,4.45 | 7.62,4.45 10.29,4.45 X5.GND@4 | 44.23,20.86 44.23,21.71 v44.62,22.1 | 44.51,19.05 44.51,20.57 44.23,20.86 | 44.23,20.86 43.2,20.86 U1.GND_2 | 75.95,13.97 C5.- 63.5,3.17 63.5,2.63 | 63.5,2.63 58.42,2.63 58.42,2.33 | X3.GND@4 63.5,2.63 | 44.51,19.05 41.2,15.73 U1.GND_1 41.2,4.45 | 58.42,2.33 50.8,2.33 50.8,2.18 | X3.GND@3 58.42,2.33 | X8.GND@4 50.8,2.18 | 50.8,2.18 49.12,2.18 46.86,4.45 45.72,4.45 45.72,3.24 | X8.GND@3 45.72,3.24 | RS485.5 71.21,50.57 71.21,46.23 | PRG.2 44.51,19.05 | UART0.4 41.27,52.91 42.12,52.07 | U$1.24 41.85,51.8 42.12,52.07 | NRF24L01+.1 52.2,52.07 | 42.12,52.07 52.2,52.07 | X2.GND@1 38.1,4.45 | 45.72,3.24 42.4,3.24 41.2,4.45 | X2.GND@3 33.02,4.45 34.18,5.6 | 41.2,4.45 38.1,4.45 | 38.1,4.45 35.33,4.45 34.18,5.6 | CC3-EXT.GND@0 CC3-EXT.GND@1 54.1,27.57 54.1,27.29 54.96,26.43 61.07,26.43 61.75,27.11 61.75,32.36 60.53,33.58 60.3,33.58 52.2,41.67 52.2,52.07
  Bottom 0.457: C3.1 68,44.95 | C8.2 64.17,49.41 64.17,48.37 67.59,44.95 68,44.95 | U$2.GND 85.09,42.4 79.27,48.23 78.66,48.23 | C9.1 77.97,50.25 78.66,49.55 78.66,48.23 | 71.21,46.23 69.93,44.95 68,44.95 | 71.21,46.23 71.36,46.08 76.51,46.08 78.66,48.23 | U$3.GND 83.57,26.38 83.57,21.59 75.95,13.97 | 89.53,4.45 84.45,4.45 | X1.GND@3 84.45,4.45 | 75.95,13.97 84.45,5.46 84.45,4.45 | X1.GND@4 89.53,4.45 | 89.53,4.45 98.88,13.79 98.88,23.86 97.89,24.85 96.39,24.85 GND.1
  pour Top: 0.64,57.78 0.64,0.64 99.69,0.64 99.69,21.59 87.63,21.59 87.63,37.47 98.42,37.47 98.42,57.78
  pour Bottom: 0.64,57.78 0.64,0.64 99.69,0.64 99.69,21.59 87.63,21.59 87.63,37.47 98.42,37.47 98.42,57.78
IRQ-A  (via drill 0.3 pad 0.61)
  Top 0.305: U$2.D2 77.47,54.34 63.59,54.34 v62.9,53.65
  Bottom 0.305: RS485.2 67.01,48.03 66.36,48.68 66.36,49.3 | RS485.3 66.36,49.3 | v62.9,53.65 62.53,53.28 62.53,53.13 | 66.36,49.3 62.53,53.13 | 62.53,53.13 55.43,53.13 54.81,52.52 54.81,45.52 NRF24L01+.8
M-RES  (via drill 0.3 pad 0.61)
  Top 0.305: 23.7,13.83 23.7,13.93 v23.8,14.03 | 23.7,13.83 23.7,4.45 X31.P$5 | 23.7,13.83 v15.66,13.83
  Bottom 0.305: IC31.29 15.4,13.57 v15.66,13.83 | v23.8,14.03 23.8,16.01 25.15,17.36 25.61,17.36 R34.2
MISO1  (via drill 0.3 pad 0.61)
  Top 0.305: v32.82,17.32 12.3,17.32 9.87,19.75 RADIO0B.MISO 9.87,22.92 10.45,23.5 CC0.MISO | RADIO3B.MISO 60.67,22.92 61.24,23.5 CC3.MISO 61.24,26.04 60.53,26.04 59.1,27.47 59.1,28.09 58.15,29.05 58.03,29.05 CC3-EXT.MISO 58.03,30.71 | RADIO1B.MISO 85.31,22.8 86.01,23.5 CC1.MISO 86.01,26.04 82.82,29.23 72.53,29.23 70.56,31.2 58.52,31.2 58.03,30.71 | 58.03,30.71 57.57,31.18 42.67,31.18 41.58,30.09 41.58,29.98 CC2-EXT.MISO 40.51,28.91 40.38,28.91 39.44,27.98 39.44,27.37 38.44,26.37 37.45,26.37 CC2.MISO 35.84,22.99 35.27,22.42 RADIO2B.MISO 35.27,19.88 34.92,19.88 v34.76,19.71
  Bottom 0.305: v34.76,19.71 32.82,17.78 v32.82,17.32 | U$1.27 34.23,47.61 33.71,47.09 33.71,45.29 34.55,44.45 36.57,44.45 38.33,42.69 38.33,39.24 40.51,37.06 CC2-EXT.MISO
MISO2  (via drill 0.3 pad 0.61)
  Top 0.305: IC2.7 16.19,51.94 17.72,50.41 17.72,48.43 21.86,44.29 36.79,44.29 38.16,42.92 38.16,42.01 40.34,39.82 v44.13,39.82
  Bottom 0.305: U$1.18 44.39,39.57 v44.13,39.82
MISO-A  (via drill 0.3 pad 0.61)
  Top 0.305: X31.P$1 26.7,1.91 40.74,15.95 v54.08,15.95 | U$2.D12 64.77,39.1 58.69,39.1 NRF24L01+.7
  Bottom 0.305: U$2.D12 64.77,39.1 65.17,38.7 65.17,25.23 55.88,15.95 v54.08,15.95
MOSI1  (via drill 0.3 pad 0.61)
  Top 0.305: 38,19.57 37.5,19.07 23.55,19.07 22.82,18.33 14.02,18.33 12.6,19.75 RADIO0B.MOSI 12.6,22.29 13.24,22.29 14.45,23.5 CC0.MOSI | CC3-EXT.MOSI 61.64,30.11 61.64,29.98 62.58,29.05 63.22,29.05 65.25,27.02 CC3.MOSI 65.25,23.5 64.17,22.42 63.4,22.42 RADIO3B.MOSI 63.4,19.88 62.91,19.38 38.2,19.38 38,19.57 | CC2-EXT.MOSI 43.05,28.91 43.18,28.91 44.12,27.98 44.12,26.98 43.52,26.37 41.61,26.37 40,24.77 CC2.MOSI 38,22.92 RADIO2B.MOSI 38,19.57 | RADIO1B.MOSI 88.04,22.27 89.27,23.5 90.01,23.5 CC1.MOSI 90.01,26.04 83.97,32.08 73.49,32.08 73.3,32.27 v60.87,32.27
  Bottom 0.305: CC3-EXT.MOSI 60.58,31.97 v60.87,32.27 | U$1.26 36.77,48.12 43.05,41.83 CC2-EXT.MOSI
MOSI-A  (via drill 0.3 pad 0.61)
  Top 0.305: X31.P$4 23.3,3.17 23.3,1.8 23.87,1.23 26.99,1.23 27.56,1.8 27.56,1.91 34.9,9.25 48.29,9.25 v55.6,16.57 | NRF24L01+.6 57.08,45.79 60.44,45.79 62.23,44 U$2.D11
  Bottom 0.305: U$2.D11 62.23,39.1 64.67,36.65 64.67,25.64 v55.6,16.57
N$1
  Top 0.457: NRF24L01+.2 56,52.19 L1.2 | C7.2 73.7,18.46 C5.+
  Bottom 0.457: NRF24L01+.2 55.88,51.23 58.78,48.33 60.6,48.33 61.38,47.55 61.38,47.14 66.14,42.38 66.14,39.72 70.1,35.75 73.14,35.75 75.88,33.01 75.88,30.05 76.7,29.23 77.17,29.23 77.95,28.45 77.95,22.7 C5.+
N$2
  Top 0.457: U$2.VCC 80.01,44.72 73.28,51.45 60.39,51.45 L1.1
N$4
  Bottom 0: 111.5,6.5 111.5,7
N$5
  Bottom 0: 108,56.5 108,56
N$6
  Bottom 0.305: 23.84,4.4 24.43,3.81 R4.2 | 23.84,4.4 23.84,7.39 25.4,8.95 Y2.P$2 | 23.84,4.4 21.45,4.4 21.23,4.18 C14.2 20.32,2.75 19.73,2.17 19.23,2.17 15.82,5.58 | IC31.7 8.16,8.74 11.32,5.58 15.82,5.58 | 15.82,5.58
N$8  (via drill 0.3 pad 0.61)
  Top 0.305: v67.17,18.83 54.18,18.83 v54.06,18.71
  Bottom 0.305: U$3.RX 75.95,25.41 69.37,18.83 v67.17,18.83 | RX.2 53.72,19.05 v54.06,18.71
N$9
  Bottom 0.305: 94.61,32.13 94.61,32.26
N$10
  Bottom 0.305: TX.2 57.39,15.24 74.37,32.23 U$3.TX
N$11
  Bottom 0.305: PRG.1 47.75,17.95 46.97,17.95 45.28,16.26 45.28,14.37 46,13.65 57.99,13.65 71.02,26.68 75.64,26.68 U$3.GPIO0
N$12
  Bottom 0.305: U$3.CH_PD 73.77,30.5 57.41,14.13 49.75,14.13 48.64,15.24 CHPD.2
N$13  (via drill 0.3 pad 0.61)
  Top 0.305: v9.89,16.05 9.99,15.95 24.6,15.95 v24.87,16.22
  Bottom 0.305: C32.1 25.4,15.88 25.21,15.88 v24.87,16.22 | IC31.20 9.76,17.32 9.89,17.19 v9.89,16.05
N$19
  Bottom 0.305: IC31.8 7.36,8.74 11.27,4.83 15.92,4.83 19.04,1.71 24.48,1.71 26.23,3.46 26.23,3.81 | 26.23,3.81 26.23,4.42 25.4,5.25 Y2.P$1 25.4,7.56 26.94,9.1 26.94,11.11 26.79,11.26 20.45,11.26 20.32,11.13 C15.2 | 26.23,3.81 R4.1
N$21
  Bottom 0.305: C8.1 63.03,46.55 67.26,42.32 67.72,42.32 68.58,41.46 68.58,39.95 70.31,38.23 76.5,38.23 82.13,32.6 R3.1 84.24,32.6 84.45,32.38 R5.1
R1-HM  (via drill 0.3 pad 0.61)
  Top 0.305: HMMOD-UART.5 82.49,38.68 79.99,38.68 76.99,35.68 54.22,35.68 50.31,31.77 28.39,31.77 v27.48,30.85
  Bottom 0.305: R1.3 27.14,30.1 27.14,30.51 v27.48,30.85
R1-MY  (via drill 0.3 pad 0.61)
  Top 0.305: v25.45,22.52 25.45,21.97 22.45,18.96 v18.83,18.96
  Bottom 0.305: IC31.31 15.39,11.97 18.83,15.41 v18.83,18.96 | R1.1 26.04,23.1 v25.45,22.52
RO-A
  Bottom 0.305: U$2.D8 65.6,52.58 67.42,52.58 68.95,51.05 68.95,46.76 RS485.1
RST  (via drill 0.3 pad 0.61)
  Top 0.305: v41.57,31.1 v32.49,31.1 | IC2.3 8.54,31.62 10.26,33.34 10.26,35.39 12.67,37.8 22.07,37.8 22.75,37.13 v28.49,37.13
  Bottom 0.305: U$1.17 41.85,32.35 41.57,32.07 v41.57,31.1 | v28.49,37.13 30.3,35.32 30.3,33.29 v32.49,31.1
RX1  (via drill 0.3 pad 0.61)
  Top 0.305: v28,51.72 46.44,51.72 46.93,51.23 U$1.22
  Bottom 0.305: 25.4,51.72 v28,51.72 | 25.4,51.72 25.4,32.82 24.93,32.35 24.93,28.57 R1.2 | UART1.3 25.4,51.72
RX-MAPLE  (via drill 0.3 pad 0.61)
  Top 0.305: U$1.30 26.61,51.23 27.75,52.37 36.96,52.37 38.73,54.15 | U$2.TX0 87.63,54.34 85.84,52.55 60.3,52.55 v58.11,54.74 | UART0.3 38.73,54.15 | v43.3,54.05 38.83,54.05 38.73,54.15
  Bottom 0.305: v43.3,54.05 44.28,53.07 52.01,53.07 53.69,54.74 v58.11,54.74
RX_DBG  (via drill 0.3 pad 0.61)
  Top 0.305: DBG.3 37.39,40.64 40.31,37.72 v57.15,37.72
  Bottom 0.305: DBG.3 37.39,40.64 37.39,37.65 35.75,36.01 34.23,36.01 U$1.14 | TX.1 51.31,16.34 51.62,16.66 54.12,16.66 64.22,26.76 64.22,30.65 v57.15,37.72
SCK1  (via drill 0.3 pad 0.61)
  Top 0.305: v34.07,18.15 23.89,18.15 23.61,17.87 13.12,17.87 11.24,19.75 RADIO0B.SCLK 11.24,22.29 | U$1.28 31.69,47.61 40.59,47.61 v40.74,47.76 | CC3-EXT.SCK 61.64,27.57 61.64,27.44 63.05,26.04 63.24,26.04 CC3.SCLK 63.24,23.5 62.17,22.42 62.04,22.42 RADIO3B.SCLK 62.04,19.88 44.05,19.88 v41.32,22.6 | CC0.SCLK 12.45,23.5 11.24,22.29 | RADIO2B.SCLK 36.64,22.42 36.77,22.42 37.84,23.5 CC2.SCLK 39.45,26.37 40.96,26.37 41.98,27.39 41.98,27.44 CC2-EXT.SCK | RADIO1B.SCLK 86.68,22.42 87.76,23.5 88.01,23.5 CC1.SCLK 88.01,26.04 82.58,31.47 72.81,31.47 72.62,31.66 59.74,31.66 v59.48,31.93 | 11.24,22.29
  Bottom 0.305: v34.07,18.15 34.4,17.82 36.84,17.82 41.32,22.31 v41.32,22.6 41.32,24.65 43.05,26.37 CC2-EXT.SCK | CC3-EXT.SCK 60.58,28.64 60.44,28.64 59.48,29.61 v59.48,31.93 59.48,33.47 45.34,47.61 40.9,47.61 v40.74,47.76
SCK2
  Top 0.305: U$1.19 46.93,36.01 13.45,36.01 12.8,35.35 12.8,33.34 11.08,31.62 IC2.4
SCK-A
  Top 0.305: U$2.D13 67.31,42.32 61.56,48.07 54.42,48.07 NRF24L01+.5
T1-HM  (via drill 0.3 pad 0.61)
  Top 0.305: v30.43,16.21 35.74,16.21 37.38,17.86 v59.1,17.86 | v26.99,20.03 26.99,22.2 v25.41,23.78 | HMMOD-UART.6 80.49,35.45 79.05,34.02 v71.33,34.02
  Bottom 0.305: v59.1,17.86 59.32,17.86 71.33,29.87 v71.33,34.02 | v25.41,23.78 24.72,23.09 24.25,23.09 21.75,25.58 21.75,30.1 T1.3 | v26.99,20.03 30.43,16.58 v30.43,16.21
T1-MY  (via drill 0.3 pad 0.61)
  Top 0.305: v24.48,23.72 24.48,21.65 22.42,19.6 18.6,19.6 v18.06,19.05
  Bottom 0.305: v18.06,19.05 18.06,15.36 15.47,12.77 IC31.30 | T1.1 22.86,25.34 v24.48,23.72
TX1  (via drill 0.3 pad 0.61)
  Top 0.305: U$1.23 44.39,51.23 31.24,51.23 30.42,50.41 30.42,48.35 28.07,46 v22.99,46
  Bottom 0.305: UART1.2 23.26,55.48 23.26,53.44 22.99,53.17 v22.99,46 22.99,32.93 23.96,31.95 23.96,28.57 T1.2
TX-MAPLE  (via drill 0.3 pad 0.61)
  Top 0.305: U$1.31 24.07,51.23 25.67,52.83 34.98,52.83 36.2,54.05 UART0.2 | U$2.RX1 85.09,54.34 83.77,53.02 60.58,53.02 58.72,54.88 58.72,54.99 57.09,56.61 54.89,56.61 51.34,53.07 v39.01,53.07
  Bottom 0.305: v39.01,53.07 38.02,54.05 36.2,54.05 UART0.2
TX_DBG
  Bottom 0.305: DBG.2 37.88,40.87 37.88,37.12 36.77,36.01 U$1.15 36.77,32.35 37.19,32.35 39.24,30.3 39.24,29.71 40.44,28.51 46.07,28.51 51.31,23.27 RX.1
VCC  (via drill 0.3 pad 0.61)
  Top 0.457: 20.32,54.96 22.19,53.09 23.02,53.09 23.3,53.37 33.05,53.37 33.66,53.98 UART0.1 | 18.45,22.36 19.76,22.36 20.53,21.59 C11.2 | 18.45,22.36 15.33,22.36 RADIO0B.VCC 16.07,20.28 v16.2,20.28 | 18.45,22.36 CC0.VCC 18.45,24.88 18.45,26.11 18.09,26.46 C1.2 | X31.P$2 20.35,1.91 v19.48,2.77 | C6.1 6.43,55.61 7.45,54.59 7.75,54.59 | 20.32,54.96 19.95,54.59 7.75,54.59 | 20.32,54.96 UART1.1 | 7.75,54.59 IC2.10 7.75,50.81 7.28,50.81 6.14,51.94 IC2.11 | 45.59,26.09 44.27,24.77 CC2.VCC | 45.59,26.09 CC2-EXT.VCC@1 CC2-EXT.VCC@0 | 45.59,26.09 46.65,25.03 46.81,25.03 C2.2 | CC3.VCC 69.25,26.11 70.31,26.11 | HMMOD-UART.1 90.49,35.38 93.66,32.2 C12.1 93.66,26.81 94.01,26.46 CC1.VCC 94.01,23.42 93.05,23.42 RADIO1B.VCC 90.77,19.8 | 70.31,26.11 70.31,27.3 C4.2 69.28,27.38 68.22,28.44 66.13,28.44 | CC3-EXT.VCC@0 64.45,30.11 66.13,28.44 | RADIO3B.VCC 66.13,28.44 | 70.31,26.11 71.01,25.41 U$3.VCC 79.99,19.8 90.77,19.8 | 90.77,19.8 v94.68,19.8 | RADIO2B.VCC v41.77,21.14 v41.77,21.15
  Bottom 0.457: 33.46,12.83 32.34,12.83 29.75,15.43 29.75,16.29 26.5,19.55 23.91,19.55 R34.1 22.88,18.41 | IC2.10 7.75,50.81 7.65,50.71 7.65,48.18 | 10.56,8.66 9.29,8.66 8.96,8.99 IC31.6 8.96,16.45 8.16,17.25 IC31.18 8.16,18.93 9.51,20.28 v16.2,20.28 16.33,20.41 19.52,20.41 19.97,19.95 R2.2 21.94,19.95 21.94,19.36 22.88,18.41 | IC31.4 10.56,8.66 | v19.48,2.77 14.86,7.39 11.83,7.39 10.56,8.66 | U$1.1 1.21,36.08 8.87,36.08 9.9,37.11 9.9,46.77 9.27,47.4 8.43,47.4 7.65,48.18 | DBG.1 37.47,45.72 37.47,46.19 35.56,48.1 35.56,50.65 36.27,51.36 | CHPD.1 46.23,16.42 47.05,16.42 48.72,18.09 | CC2-EXT.VCC@1 45.59,26.3 44.45,25.15 44.45,24.66 | 33.46,12.83 35.2,11.09 U1.3.3V | 33.46,12.83 v41.77,21.15 42.17,21.55 42.17,24.36 42.48,24.66 44.45,24.66 | C31.1 22.54,18.07 22.88,18.41 | U$2.RAW 87.63,39.44 | C3.2 70.93,43.81 72.22,42.52 82.91,42.52 83.82,41.6 83.82,39.86 84.69,38.99 87.18,38.99 87.63,39.44 | HMMOD-UART.1 90.49,38.75 88.32,38.75 87.63,39.44 | 3V3.1 95.43,19.05 v94.68,19.8 | CC3-EXT.VCC@0 CC3-EXT.VCC@1 63.12,26.43 54.51,17.83 48.97,17.83 48.72,18.09 | UART0.1 33.66,53.98 36.27,51.36 | CC2-EXT.VCC@0 45.59,40.05 38.04,47.6 38.04,50.52 37.2,51.36 36.27,51.36 | 44.45,24.66 48.72,20.39 48.72,18.09 | U$1.40 1.21,47.53 7,47.53 7.65,48.18
VDD
  Top 0.457: F2.P$2 F2.P$1 97.79,38.8 X7.1
  Bottom 0.457: F1.P$1 93.34,42.29 94.3,42.29 X7.1 95.14,38.9 95.14,36.21 97.65,33.7 97.65,32.66 95.16,30.17 95.16,25.2 96.3,24.06 97.16,24.06 97.92,23.3 5V.1 3V3.2
WIZ_CS
  Top 0.305: IC2.5 12.83,29.06 17.1,29.06 20.39,32.35 49.47,32.35 U$1.20
WIZ_RST  (via drill 0.3 pad 0.61)
  Top 0.305: v38.5,37.82 36.79,39.54 33.82,39.54 32.98,40.38 20.67,40.38 12.83,48.22 IC2.8
  Bottom 0.305: U$1.16 39.31,37.02 v38.5,37.82

### Text on the board
tNames: GND | RX | TX | VCC | GND | R | T | + | + | CS | VCC | - | - | GND | + | T | MAPLE CUN / - large - | R | GND | 31 | - | SCK | - | LAN | CC3 | Ant0 | Ant2 | Ant3 | Ant1
bNames: RS485 | + | + | - | MAPLE CUN | NRF24L01 w. / PA +LNA | + | + | Version 2.1 / www.neuby.de | A | A | ESP8266 | B | B | HM | HM | - | - | MYS | MYS | Socket CC1101 / Transc. 2+3 | MySensors / RFM69 | ESP8266 | Ant1 | Ant0 | Ant3 | Ant2